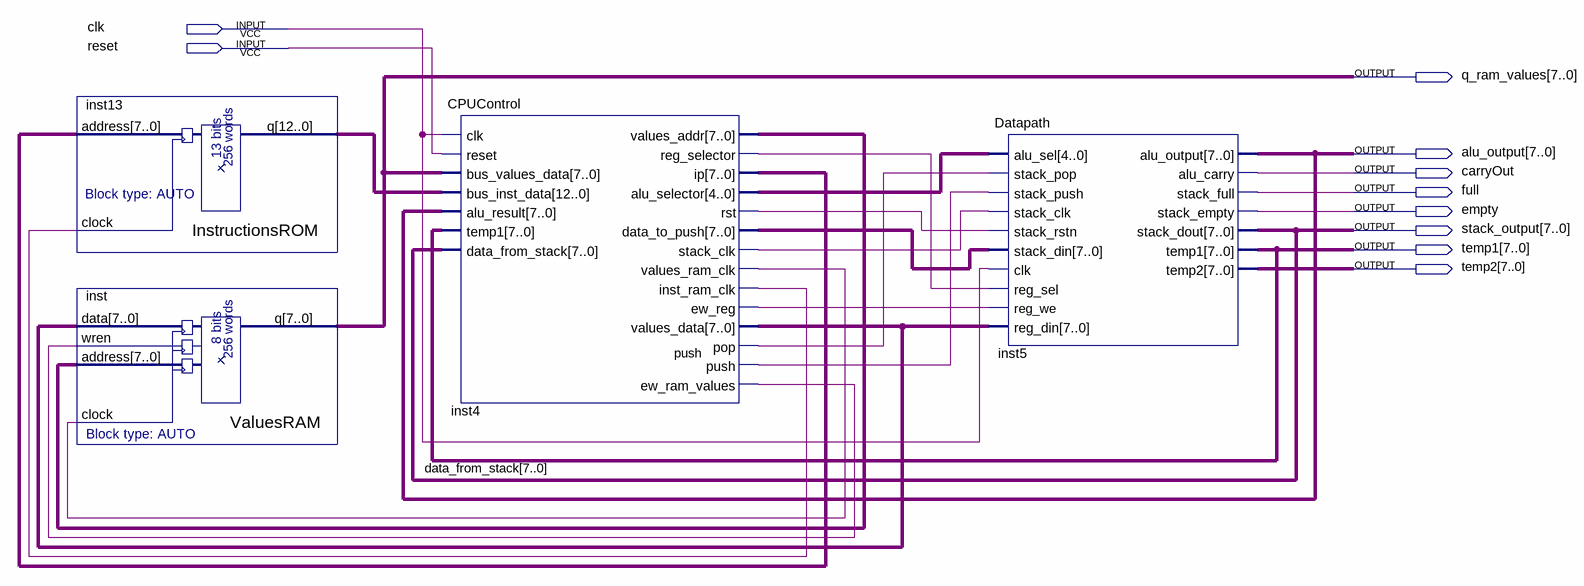
[diagram p0: schematic sheet]
// Quartus schematic Processador.bdf as structural Verilog: 4 symbols, 10 pins
module Processador (
  input  clk,
  input  reset,
  output [7:0] q_ram_values,
  output [7:0] alu_output,
  output carryOut,
  output full,
  output empty,
  output [7:0] stack_output,
  output [7:0] temp1,
  output [7:0] temp2
);

  wire inst4_ew_ram_values, inst4_ew_reg, inst4_inst_ram_clk, inst4_pop, inst4_reg_selector, inst4_rst,
       inst4_stack_clk, inst4_values_ram_clk, push;
  wire [4:0] inst4_alu_selector;
  wire [7:0] inst4_data_to_push, inst4_ip, inst4_values_addr, inst4_values_data;
  wire [12:0] inst13_q;

  InstructionsROM inst13 (.address(inst4_ip), .clock(inst4_inst_ram_clk), .q(inst13_q));
  ValuesRAM inst (
    .data(inst4_values_data), .wren(inst4_ew_ram_values), .address(inst4_values_addr),
    .clock(inst4_values_ram_clk), .q(q_ram_values));
  CPUControl inst4 (
    .clk(clk), .reset(reset), .bus_values_data(q_ram_values), .bus_inst_data(inst13_q),
    .alu_result(alu_output), .temp1(temp1), .data_from_stack(stack_output), .values_addr(inst4_values_addr),
    .reg_selector(inst4_reg_selector), .ip(inst4_ip), .alu_selector(inst4_alu_selector), .rst(inst4_rst),
    .data_to_push(inst4_data_to_push), .stack_clk(inst4_stack_clk), .values_ram_clk(inst4_values_ram_clk),
    .inst_ram_clk(inst4_inst_ram_clk), .ew_reg(inst4_ew_reg), .values_data(inst4_values_data),
    .pop(inst4_pop), .push(push), .ew_ram_values(inst4_ew_ram_values));
  Datapath inst5 (
    .alu_sel(inst4_alu_selector), .stack_pop(inst4_pop), .stack_push(push), .stack_clk(inst4_stack_clk),
    .stack_rstn(inst4_rst), .stack_din(inst4_data_to_push), .clk(clk), .reg_sel(inst4_reg_selector),
    .reg_we(inst4_ew_reg), .reg_din(inst4_values_data), .alu_output(alu_output), .alu_carry(carryOut),
    .stack_full(full), .stack_empty(empty), .stack_dout(stack_output), .temp1(temp1), .temp2(temp2));

  // Other names for the same wires on the sheet: data_from_stack[7:0] = stack_output
endmodule
